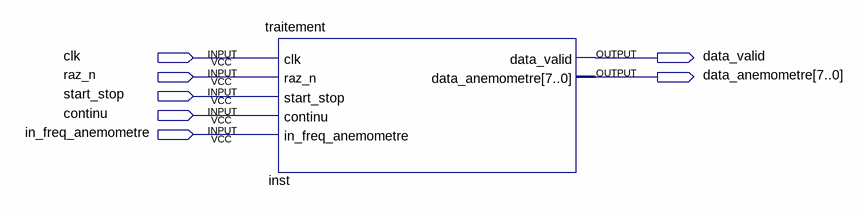
[diagram p0: schematic sheet]
// Quartus schematic Anemo_final.bdf as structural Verilog: 1 symbols, 7 pins
module Anemo_final (
  input  clk,
  input  raz_n,
  input  start_stop,
  input  continu,
  input  in_freq_anemometre,
  output data_valid,
  output [7:0] data_anemometre
);

  traitement inst (
    .clk(clk), .raz_n(raz_n), .start_stop(start_stop), .continu(continu),
    .in_freq_anemometre(in_freq_anemometre), .data_valid(data_valid), .data_anemometre(data_anemometre));
endmodule
